# Altium project LimePSB-RPCM_1v2.PrjPcb (part 8 of 13)

## Sheet 11_RFFE.SchDoc: RF front end
size A3; Organization: Lime Microsystems; Address1: Surrey Tech Centre; Address2: Guildford GU2 7YG; Address3: Surrey; Address4: United Kingdom; Revision: v1.2; SheetNumber: 11; SheetTotal: 13
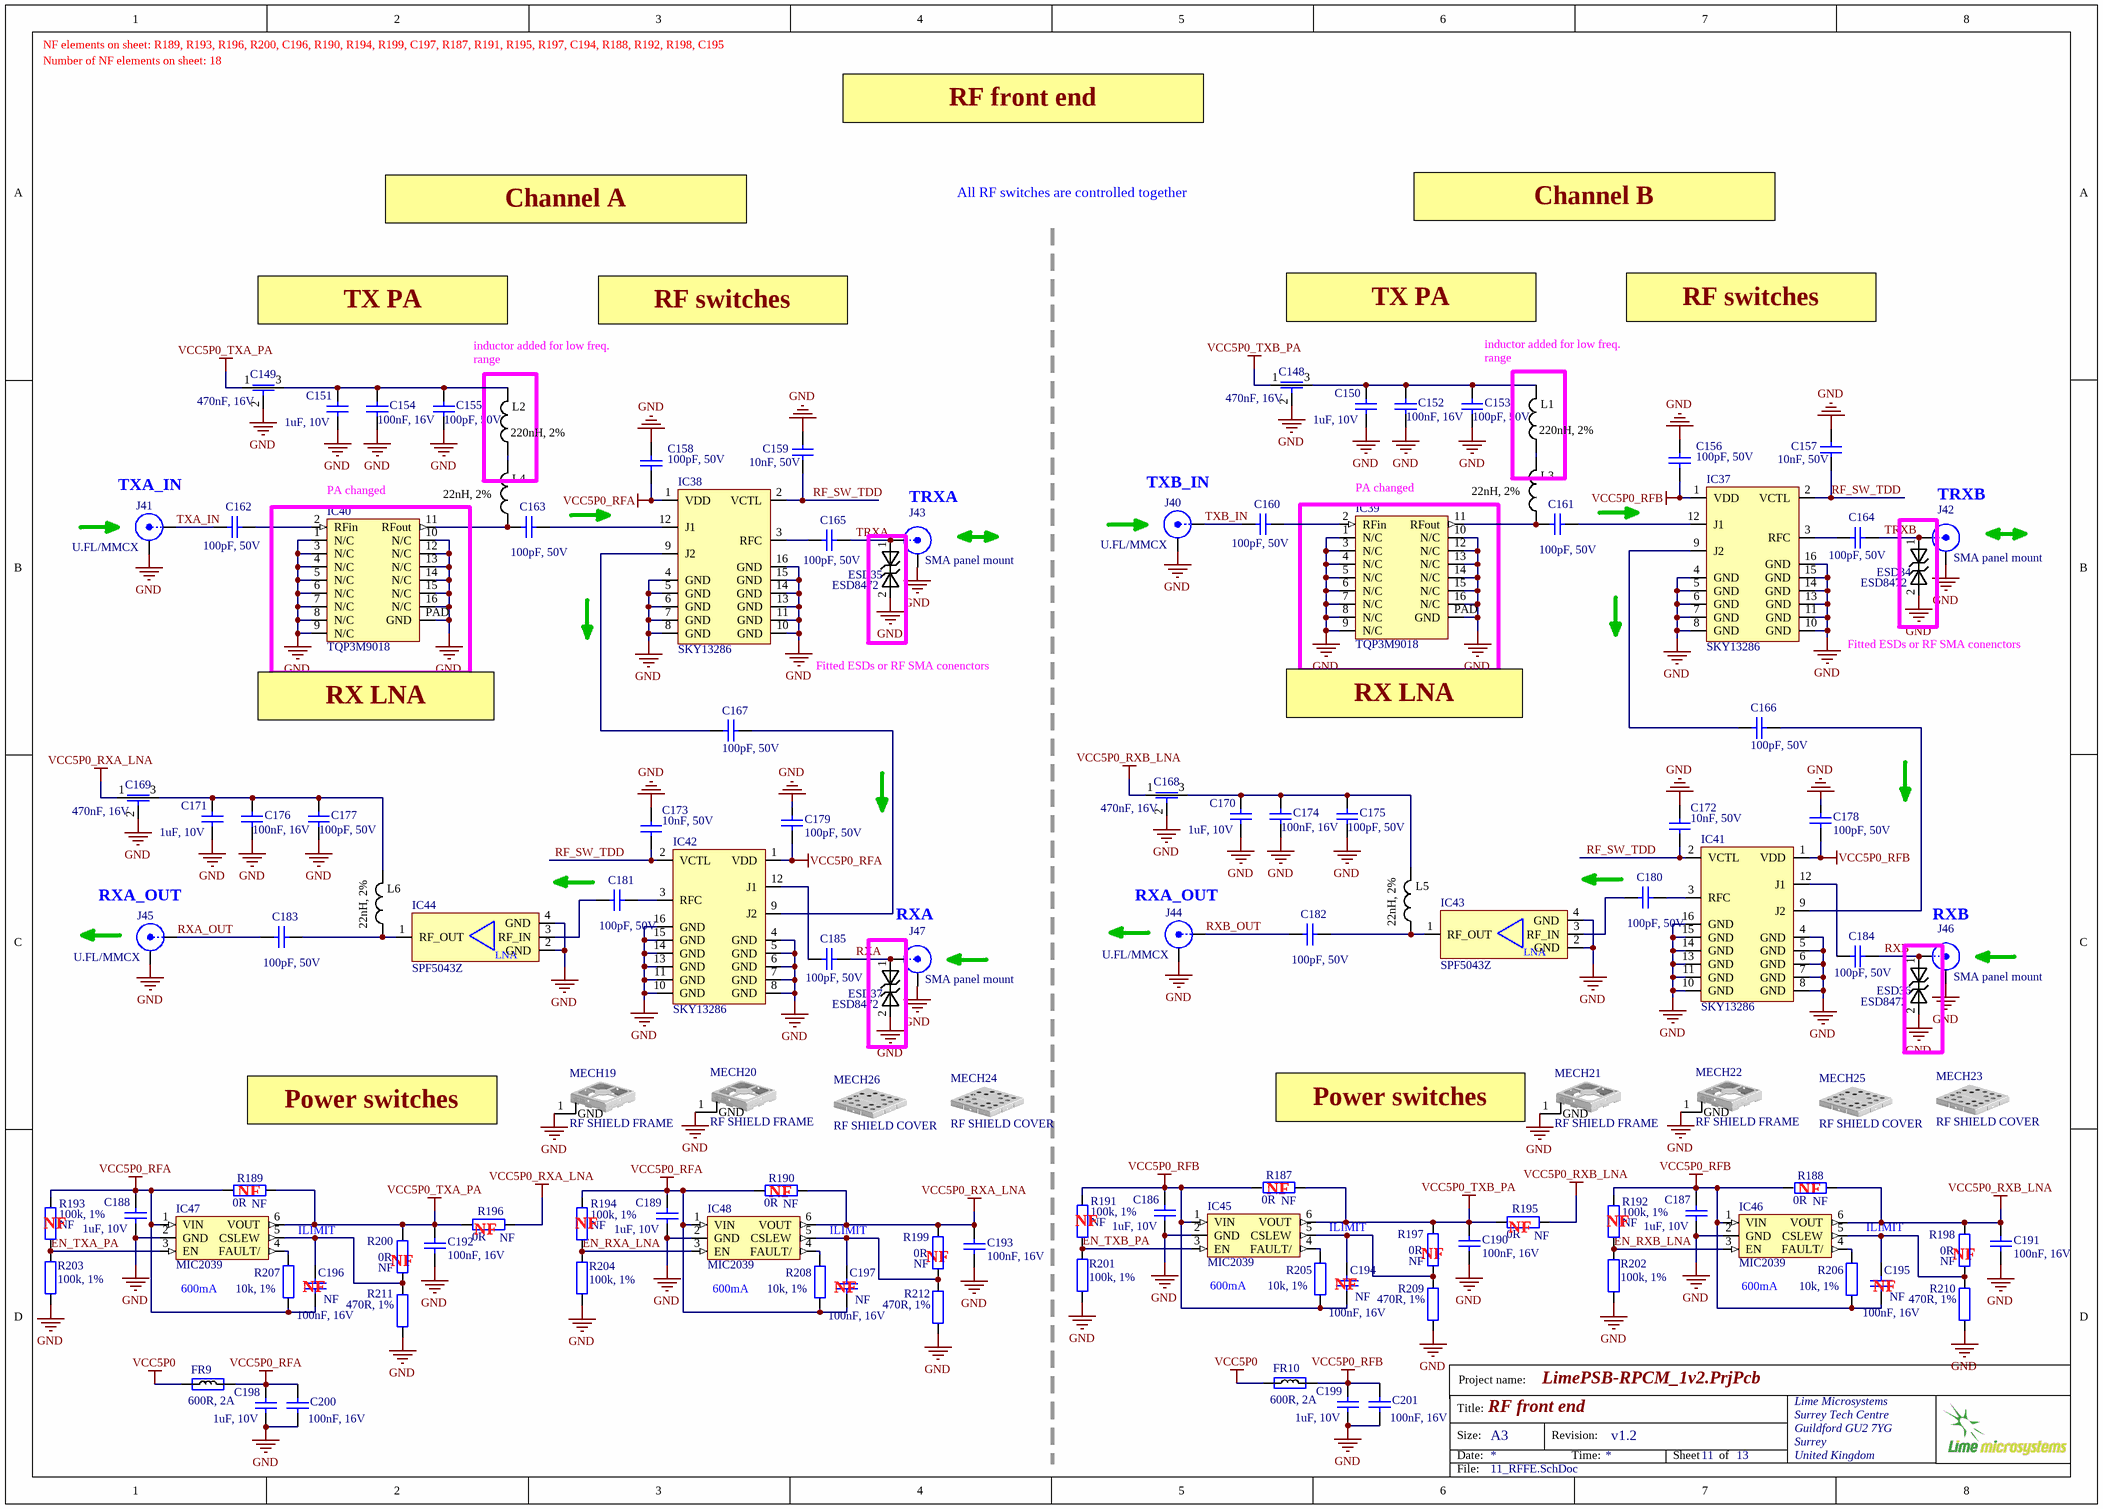
[diagram p10: 11_RFFE.SchDoc]

### Parts
C148  470nF, 16V  [CAP0805_FEEDTHROUGH]
C149  470nF, 16V  [CAP0805_FEEDTHROUGH]
C150  1uF, 10V  [CAP0402]
C151  1uF, 10V  [CAP0402]
C152  100nF, 16V  [CAP0402]
C153  100pF, 50V  [CAP0402]
C154  100nF, 16V  [CAP0402]
C155  100pF, 50V  [CAP0402]
C156  100pF, 50V  [CAP0402]
C157  10nF, 50V  [CAP0402]
C158  100pF, 50V  [CAP0402]
C159  10nF, 50V  [CAP0402]
C160  100pF, 50V  [CAP0402]
C161  100pF, 50V  [CAP0402]
C162  100pF, 50V  [CAP0402]
C163  100pF, 50V  [CAP0402]
C164  100pF, 50V  [CAP0402]
C165  100pF, 50V  [CAP0402]
C166  100pF, 50V  [CAP0402]
C167  100pF, 50V  [CAP0402]
C168  470nF, 16V  [CAP0805_FEEDTHROUGH]
C169  470nF, 16V  [CAP0805_FEEDTHROUGH]
C170  1uF, 10V  [CAP0402]
C171  1uF, 10V  [CAP0402]
C172  10nF, 50V  [CAP0402]
C173  10nF, 50V  [CAP0402]
C174  100nF, 16V  [CAP0402]
C175  100pF, 50V  [CAP0402]
C176  100nF, 16V  [CAP0402]
C177  100pF, 50V  [CAP0402]
C178  100pF, 50V  [CAP0402]
C179  100pF, 50V  [CAP0402]
C180  100pF, 50V  [CAP0402]
C181  100pF, 50V  [CAP0402]
C182  100pF, 50V  [CAP0402]
C183  100pF, 50V  [CAP0402]
C184  100pF, 50V  [CAP0402]
C185  100pF, 50V  [CAP0402]
C186  1uF, 10V  [CAP0402]
C187  1uF, 10V  [CAP0402]
C188  1uF, 10V  [CAP0402]
C189  1uF, 10V  [CAP0402]
C190  100nF, 16V  [CAP0402]
C191  100nF, 16V  [CAP0402]
C192  100nF, 16V  [CAP0402]
C193  100nF, 16V  [CAP0402]
C194  100nF, 16V  Assembly Info: NF  [CAP0402]
C195  100nF, 16V  Assembly Info: NF  [CAP0402]
C196  100nF, 16V  Assembly Info: NF  [CAP0402]
C197  100nF, 16V  Assembly Info: NF  [CAP0402]
C198  1uF, 10V  [CAP0402]
C199  1uF, 10V  [CAP0402]
C200  100nF, 16V  [CAP0402]
C201  100nF, 16V  [CAP0402]
ESD34  ESD8472  [ESD8472_X3DFN2]
ESD35  ESD8472  [ESD8472_X3DFN2]
ESD36  ESD8472  [ESD8472_X3DFN2]
ESD37  ESD8472  [ESD8472_X3DFN2]
FR9  600R, 2A  [RES0805]
FR10  600R, 2A  [RES0805]
IC37  SKY13286  [SKY13286-359LF_RF_switch_QFN16]
IC38  SKY13286  [SKY13286-359LF_RF_switch_QFN16]
IC39  TQP3M9018  [TQP3M9018_PA_QFN16]
IC40  TQP3M9018  [TQP3M9018_PA_QFN16]
IC41  SKY13286  [SKY13286-359LF_RF_switch_QFN16]
IC42  SKY13286  [SKY13286-359LF_RF_switch_QFN16]
IC43  SPF5043Z  [SPF5043Z_SOT-343]
IC44  SPF5043Z  [SPF5043Z_SOT-343]
IC45  MIC2039  [SOT23-6]
IC46  MIC2039  [SOT23-6]
IC47  MIC2039  [SOT23-6]
IC48  MIC2039  [SOT23-6]
J40  U.FL/MMCX  [MMCX_UFL_conn_u]
J41  U.FL/MMCX  [MMCX_UFL_conn_u]
J42  SMA panel mount  [SMA_connector_side]
J43  SMA panel mount  [SMA_connector_side]
J44  U.FL/MMCX  [MMCX_UFL_conn_u]
J45  U.FL/MMCX  [MMCX_UFL_conn_u]
J46  SMA panel mount  [SMA_connector_side]
J47  SMA panel mount  [SMA_connector_side]
L1  220nH, 2%  [RES0603]
L2  220nH, 2%  [RES0603]
L3  22nH, 2%  [RES0603]
L4  22nH, 2%  [RES0603]
L5  22nH, 2%  [RES0603]
L6  22nH, 2%  [RES0603]
MECH19  RF SHIELD FRAME  [RF_SHIELD_FRAME_16P5x16P5_2118716-2_v1]
MECH20  RF SHIELD FRAME  [RF_SHIELD_FRAME_16P5x16P5_2118716-2_v1]
MECH21  RF SHIELD FRAME  [RF_SHIELD_FRAME_16P5x16P5_2118716-2_v1]
MECH22  RF SHIELD FRAME  [RF_SHIELD_FRAME_16P5x16P5_2118716-2_v1]
MECH23  RF SHIELD COVER  [RF_SHIELD_COVER_16Px916P9_2118715-2]
MECH24  RF SHIELD COVER  [RF_SHIELD_COVER_16Px916P9_2118715-2]
MECH25  RF SHIELD COVER  [RF_SHIELD_COVER_16Px916P9_2118715-2]
MECH26  RF SHIELD COVER  [RF_SHIELD_COVER_16Px916P9_2118715-2]
R187  0R  Assembly Info: NF  [RES0402]
R188  0R  Assembly Info: NF  [RES0402]
R189  0R  Assembly Info: NF  [RES0402]
R190  0R  Assembly Info: NF  [RES0402]
R191  100k, 1%  Assembly Info: NF  [RES0402]
R192  100k, 1%  Assembly Info: NF  [RES0402]
R193  100k, 1%  Assembly Info: NF  [RES0402]
R194  100k, 1%  Assembly Info: NF  [RES0402]
R195  0R  Assembly Info: NF  [RES0805]
R196  0R  Assembly Info: NF  [RES0805]
R197  0R  Assembly Info: NF  [RES0402]
R198  0R  Assembly Info: NF  [RES0402]
R199  0R  Assembly Info: NF  [RES0402]
R200  0R  Assembly Info: NF  [RES0402]
R201  100k, 1%  [RES0402]
R202  100k, 1%  [RES0402]
R203  100k, 1%  [RES0402]
R204  100k, 1%  [RES0402]
R205  10k, 1%  [RES0402]
R206  10k, 1%  [RES0402]
R207  10k, 1%  [RES0402]
R208  10k, 1%  [RES0402]
R209  470R, 1%  [RES0402]
R210  470R, 1%  [RES0402]
R211  470R, 1%  [RES0402]
R212  470R, 1%  [RES0402]

### Blocks framed on the sheet
RXA: ESD37

### Nets
GND: C148.2 C149.2 C150.1 C151.1 C152.2 C153.1 C154.2 C155.1 C156.2 C157.1 C158.2 C159.1 C168.2 C169.2 C170.1 C171.1 C172.2 C173.2 C174.2 C175.1 C176.2 C177.1 C178.2 C179.2 C186.2 C187.2 C188.2 C189.2 C190.2 C191.2 C192.2 C193.2 C198.1 C199.1 C200.2 C201.2 ESD34.2 ESD35.2 ESD36.2 ESD37.2 IC37.4(GND) IC37.5(GND) IC37.6(GND) IC37.7(GND) IC37.8(GND) IC37.10(GND) IC37.11(GND) IC37.13(GND) IC37.14(GND) IC37.15(GND) IC37.16(GND) IC38.4(GND) IC38.5(GND) IC38.6(GND) IC38.7(GND) IC38.8(GND) IC38.10(GND) IC38.11(GND) IC38.13(GND) IC38.14(GND) IC38.15(GND) IC38.16(GND) IC39.1(N/C) IC39.3(N/C) IC39.4(N/C) IC39.5(N/C) IC39.6(N/C) IC39.7(N/C) IC39.8(N/C) IC39.9(N/C) IC39.10(N/C) IC39.12(N/C) IC39.13(N/C) IC39.14(N/C) IC39.15(N/C) IC39.16(N/C) IC39.PAD(GND) IC40.1(N/C) IC40.3(N/C) IC40.4(N/C) IC40.5(N/C) IC40.6(N/C) IC40.7(N/C) IC40.8(N/C) IC40.9(N/C) IC40.10(N/C) IC40.12(N/C) IC40.13(N/C) IC40.14(N/C) IC40.15(N/C) IC40.16(N/C) IC40.PAD(GND) IC41.4(GND) IC41.5(GND) IC41.6(GND) IC41.7(GND) IC41.8(GND) IC41.10(GND) IC41.11(GND) IC41.13(GND) IC41.14(GND) IC41.15(GND) IC41.16(GND) IC42.4(GND) IC42.5(GND) IC42.6(GND) IC42.7(GND) IC42.8(GND) IC42.10(GND) IC42.11(GND) IC42.13(GND) IC42.14(GND) IC42.15(GND) IC42.16(GND) IC43.2(GND) IC43.4(GND) IC44.2(GND) IC44.4(GND) IC45.2(GND) IC46.2(GND) IC47.2(GND) IC48.2(GND) J40.2(Y) J41.2(Y) J42.2(Y) J43.2(Y) J44.2(Y) J45.2(Y) J46.2(Y) J47.2(Y) MECH19.1(GND) MECH20.1(GND) MECH21.1(GND) MECH22.1(GND) R201.2 R202.2 R203.2 R204.2 R209.1 R210.1 R211.1 R212.1
VCC5P0: FR9.1 FR10.1
VCC5P0_RFA: C158.1 C179.1 C188.1 C189.1 C196.2 C197.2 C198.2 C200.1 FR9.2 IC38.1(VDD) IC42.1(VDD) IC47.1(VIN) IC48.1(VIN) R189.2 R190.2 R193.1 R194.1 R207.1 R208.1
VCC5P0_RFB: C156.1 C178.1 C186.1 C187.1 C194.2 C195.2 C199.2 C201.1 FR10.2 IC37.1(VDD) IC41.1(VDD) IC45.1(VIN) IC46.1(VIN) R187.2 R188.2 R191.1 R192.1 R205.1 R206.1
VCC5P0_RXA_LNA: C169.1 C193.1 IC48.6(VOUT) R190.1 R196.1 R199.2
VCC5P0_RXB_LNA: C168.1 C191.1 IC46.6(VOUT) R188.1 R195.1 R198.2
VCC5P0_TXA_PA: C149.1 C192.1 IC47.6(VOUT) R189.1 R196.2 R200.2
VCC5P0_TXB_PA: C148.1 C190.1 IC45.6(VOUT) R187.1 R195.2 R197.2
EN_RXA_LNA: IC48.3(EN) R194.2 R204.1
EN_RXB_LNA: IC46.3(EN) R192.2 R202.1
EN_TXA_PA: IC47.3(EN) R193.2 R203.1
EN_TXB_PA: IC45.3(EN) R191.2 R201.1
RF_SW_TDD: C157.2 C159.2 C172.1 C173.1 IC37.2(VCTL) IC38.2(VCTL) IC41.2(VCTL) IC42.2(VCTL)
RXA: C185.1 ESD37.1 J47.1(X)
RXA_OUT: C183.2 J45.1(X)
RXB: C184.1 ESD36.1 J46.1(X)
RXB_OUT: C182.2 J44.1(X)
TRXA: C165.1 ESD35.1 J43.1(X)
TRXB: C164.1 ESD34.1 J42.1(X)
TXA_IN: C162.2 J41.1(X)
TXB_IN: C160.2 J40.1(X)
NetC148_3: C148.3 C150.2 C152.1 C153.2 L1.1
NetC149_3: C149.3 C151.2 C154.1 C155.2 L2.1
NetC160_1: C160.1 IC39.2(RFin)
NetC161_1: C161.1 IC37.12(J1)
NetC161_2: C161.2 IC39.11(RFout) L3.2
NetC162_1: C162.1 IC40.2(RFin)
NetC163_1: C163.1 IC38.12(J1)
NetC163_2: C163.2 IC40.11(RFout) L4.2
NetC164_2: C164.2 IC37.3(RFC)
NetC165_2: C165.2 IC38.3(RFC)
NetC166_1: C166.1 IC41.9(J2)
NetC166_2: C166.2 IC37.9(J2)
NetC167_1: C167.1 IC42.9(J2)
NetC167_2: C167.2 IC38.9(J2)
NetC168_3: C168.3 C170.2 C174.1 C175.2 L5.1
NetC169_3: C169.3 C171.2 C176.1 C177.2 L6.1
NetC180_1: C180.1 IC41.3(RFC)
NetC180_2: C180.2 IC43.3(RF_IN)
NetC181_1: C181.1 IC42.3(RFC)
NetC181_2: C181.2 IC44.3(RF_IN)
NetC182_1: C182.1 IC43.1(RF_OUT) L5.2
NetC183_1: C183.1 IC44.1(RF_OUT) L6.2
NetC184_2: C184.2 IC41.12(J1)
NetC185_2: C185.2 IC42.12(J1)
NetC194_1: C194.1 IC45.5(CSLEW) R197.1 R209.2
NetC195_1: C195.1 IC46.5(CSLEW) R198.1 R210.2
NetC196_1: C196.1 IC47.5(CSLEW) R200.1 R211.2
NetC197_1: C197.1 IC48.5(CSLEW) R199.1 R212.2
NetIC45_4: IC45.4(FAULT/) R205.2
NetIC46_4: IC46.4(FAULT/) R206.2
NetIC47_4: IC47.4(FAULT/) R207.2
NetIC48_4: IC48.4(FAULT/) R208.2
NetL1_2: L1.2 L3.1
NetL2_2: L2.2 L4.1

### Notes on the sheet
- NF elements on sheet: R189, R193, R196, R200, C196, R190, R194, R199, C197, R187, R191, R195, R197, C194, R188, R192, R198, C195
- Number of NF elements on sheet: 18
- RF front end
- Channel A
- All RF switches are controlled together
- Channel B
- TX PA
- RF switches
- inductor added for low freq. range
- (near J41) TXA_IN
- (near IC40) PA changed
- TRXA
- (near J40) TXB_IN
- (near IC39) PA changed
- TRXB
- (near IC40) RX LNA
- Fitted ESDs or RF SMA conenctors
- (near IC39) RX LNA
- (near J45) RXA_OUT
- (near J44) RXA_OUT
- RXB
- Power switches
- (near MECH21) Power switches
- (near R187) NF
- (near R188) NF
- (near R193) NF
- (near R189) NF
- ILIMIT
- (near R196) NF
- (near R194) NF
- (near R190) NF
- (near R199) NF
- (near R191) NF
- (near R197) NF
- (near R195) NF
- (near R192) NF
- (near R198) NF
- (near IC47) 600mA
- NF
- (near R200) NF
- (near IC48) 600mA
- (near IC45) 600mA
- (near IC46) 600mA
- (near C195) NF
- Project name:
- Title:
- Size:
- Date:
- A3
- Revision:
- Time:
- Sheet
- of
- File:
- (in symbol SPF5043Z_RF_LNA) LNA

### Library data of the parts
C148 C149 C168 C169 = Cap_feed_through: Part Description: 0.47µF Feed Through Capacitor 16V 2A 30mOhm 0805 (2012 Metric), 3 PC Pad; Manufacturer: Murata; Manufacturer Part Number 1: NFM21PC474R1C3D; Max Current Rating: 2A; Tolerance: 20%; DC Resistance (DCR): 30mR; Insulation Resistance: 1GR; Value: 470nF, 16V; Supplier 1: Digi-Key; Supplier Part Number 1: 490-2537-1-ND; Stock 1: 220606; Pricing 1: 1=0,25000, 10=0,22900, 25=0,21840, 50=0,21160, 100=0,20450, 250=0,19392, 500=0,16218, 1000=0,12586 (USD); Mount: Surface Mount,PCB; Case/Package: 0805; Weight: 0.000194oz; Case Code (Metric): 2012; Case Code (Imperial): 0805; Min Operating Temperature: -55°C; Max Operating Temperature: 125°C; Package Quantity: 1; Capacitance: 470nF; Packaging: Tape and Reel; Max Voltage Rating (DC): 16V; Current Rating: 2A; Voltage Rating: 16V; Voltage Rating (DC): 16V; Voltage: 16V; Current: 2A; Termination: Flat; Length: 2mm; Height: 0.85mm; Width: 1.25mm; Depth: 1.25mm; Radiation Hardening: No; REACH SVHC: No SVHC; Lead Free: Lead Free; RoHS: Yes
C150 C151 C170 C171 C198 C199 = Cap_0402: as C105 on sheet 10_Clock; Value: 1uF, 10V; Supplier 1: Digi-Key; Supplier Part Number 1: 311-1732-1-ND; RoHS: RoHS Compliant; Applications: General Purpose; Category: Capacitors; ComponentLink1Description: http://www.yageo.com/documents/recent/UPY-GPHC_X5R_4V-to-50V_25.pdf; ComponentLink1URL: http://www.yageo.com/documents/recent/UPY-GPHC_X5R_4V-to-50V_25.pdf; Failure Rate: -; Features: -; Height - Seated (Max): -; Lead Spacing: -; Lead Style: -; Mounting Type: Surface Mount, MLCC; Operating Temperature: -55°C ~ 85°C; Package / Case: 0402 (1005 Metric); Packaging: Cut Tape (CT); Part Status: Active; Pricing 1: 1=0.22, 10=0.156, 100=0.0732, 500=0.0513, 1000=0.04248, 2500=0.03953, 5000=0.03617 (USD); Ratings: -; Size / Dimension: 0.039" L x 0.020" W (1.00mm x 0.50mm); Stock 1: 69600; Temperature Coefficient: X5R; Thickness (Max): 0.022" (0.55mm); Voltage - Rated: 10V
C152 C154 C174 C176 C190-C197 = Cap_0402: as C118 on sheet 10_Clock; Value: 100nF, 16V; Supplier 1: Mouser; Supplier Part Number 1: 81-GRM155R71C104KA88; Case Code - in: 0402; RoHS: RoHS Compliant; Operating Temperature Range: - 55 C to + 125 C; Series: GRM; Termination Style: SMD/SMT; Package / Case: 0402 (1005 metric); Voltage Rating DC: 16 V; Maximum Operating Temperature: + 125 C; Case Code - mm: 1005; Minimum Operating Temperature: - 55 C; Product Category: Low & Medium Capacitance SMD Ceramic Chip Capacitors; Packaging: Reel; Product: General Type MLCCs; Category: Multilayer Ceramic Capacitors MLCC - SMD/SMT; Brand: Murata Electronics; Case Width: 0.5 mm; RoHS - Mouser: Y; Standard Pack Qty: 10000; Minimum Order Quantity: 1; Reeling: True; Manufacturer Part Number: GRM155R71C104KA88D
C153 C155 C156 C158 C160-C167 C175 C177-C185 = Cap_0402: as C99 on sheet 10_Clock; Value: 100pF, 50V; Capacitance: 100pF; Thickness (Max): 0.022" (0.55mm); Size / Dimension: 0.039" L x 0.020" W (1.00mm x 0.50mm); RoHS: RoHS Compliant; Ratings: -; Package / Case: 0402 (1005 Metric); Mounting Type: Surface Mount, MLCC; Height - Seated (Max): -; Features: -; Lead Spacing: -; Voltage - Rated: 50V; Operating Temperature: -55°C ~ 125°C; Packaging: Cut Tape (CT); Applications: General Purpose; Lead Style: -; Supplier 1: Digi-Key; Category: Capacitors; Supplier Part Number 1: 311-1024-1-ND
C157 C159 C172 C173 = Cap_0402: Part Description: 10000pF ±10% 50V Ceramic Capacitor X7R 0402 (1005 Metric); Manufacturer: Murata Electronics North America; Manufacturer Part Number 1: GRM155R71H103KA88D; Tolerance: ±10%; Temperature Coefficient: X7R; Value: 10nF, 50V; Supplier 1: Digi-Key; Supplier Part Number 1: 490-4516-2-ND; RoHS: RoHS Compliant; Category: Capacitors; Stock 1: 10970000; Pricing 1: 10000=0.00185, 20000=0.00176, 30000=0.00167 (USD); Packaging: Tape & Reel (TR); Part Status: Active; Voltage - Rated: 50V; Operating Temperature: -55°C ~ 125°C; Features: -; Ratings: -; Applications: General Purpose; Mounting Type: Surface Mount, MLCC; Package / Case: 0402 (1005 Metric); Size / Dimension: 0.039" L x 0.020" W (1.00mm x 0.50mm); Height - Seated (Max): -; Thickness (Max): 0.022" (0.55mm); Lead Spacing: -; Lead Style: -; ComponentLink1URL: http://www.murata.com/~/media/webrenewal/support/library/catalog/products/capacitor/mlcc/c02e.ashx?la=en-us; ComponentLink1Description: http://www.murata.com/~/media/webrenewal/support/library/catalog/products/capacitor/mlcc/c02e.ashx?la=en-us
C186-C189 = Cap_0402: as C120 on sheet 10_Clock; Value: 1uF, 10V; Supplier 1: Digi-Key; Supplier Part Number 1: 311-1732-1-ND; MSL: -; RoHS: YES
C200 C201 = Cap_0603: as C129 on sheet 10_Clock; Supplier 1: Mouser; Supplier Part Number 1: 81-GRM155R71C104KA88; Case Code - in: 0402; Manufacturer: Murata Electronics; Category: Multilayer Ceramic Capacitors MLCC - SMD/SMT; Voltage Rating DC: 16 V; Value: 100nF, 16V; Manufacturer Part Number: GRM155R71C104KA88D; Case Code - mm: 1005; Case Width: 0.5 mm; Maximum Operating Temperature: + 125 C; Minimum Operating Temperature: - 55 C; Minimum Order Quantity: 1; Operating Temperature Range: - 55 C to + 125 C; Package / Case: 0402 (1005 metric); Packaging: Reel; Product: General Type MLCCs; Product Category: Low & Medium Capacitance SMD Ceramic Chip Capacitors; Reeling: True; RoHS - Mouser: Y; RoHS: RoHS Compliant; Series: GRM; Standard Pack Qty: 10000; Termination Style: SMD/SMT
ESD34-ESD37 = ESD8472: Manufacturer: ON Semiconductor; Manufacturer Part Number 1: ESD8472MUT5G; Part Description: TVS DIODE 5.3VWM 14VC X3DFN2; Voltage - Reverse Standoff (Typ): 5.3V (Max); Voltage - Breakdown (Min): 7V; Voltage - Clamping (Max) @ Ipp: 14V; Current - Peak Pulse (10/1000µs): 3A (8/20µs); Power Line Protection: No; Capacitance @ Frequency: 0.2pF @ 1MHz; Supplier 1: Digi-Key; RoHS: RoHS Compliant; Category: Circuit Protection; Stock 1: 2295; Pricing 1: 1=0.39, 10=0.315, 100=0.2142, 500=0.16068, 1000=0.12051 (USD); Packaging: Cut Tape (CT); Part Status: Active; Type: Zener; Power - Peak Pulse: -; Applications: Automotive, RF Antenna; Operating Temperature: -55°C ~ 150°C (TJ); Mounting Type: Surface Mount; Package / Case: 2-XFDFN; Supplier Device Package: 2-X3DFN (0.62x0.32); ComponentLink1URL: http://www.onsemi.com/pub/Collateral/ESD8472-D.PDF; ComponentLink1Description: http://www.onsemi.com/pub/Collateral/ESD8472-D.PDF; Supplier Part Number 1: ESD8472MUT5GOSCT-ND
FR9 FR10 = Ferrite: Manufacturer Part Number 1: MPZ2012S601AT000; Manufacturer: TDK Corporation; Part Description: FERRITE BEAD 600 OHM 0805 1LN; Filter Type: Differential Mode - Single; Impedance @ Frequency: 600 Ohm @ 100MHz; DC Resistance (DCR): 100 mOhm Max; Supplier 1: Digi-Key; Supplier Part Number 1: 445-2206-2-ND; Mounting Type: Surface Mount; RoHS: RoHS Compliant; Height (Max): 0.041" (1.05mm); Packaging: Tape & Reel (TR); Category: Filters; Current Rating: 2A; Package / Case: 0805 (2012 Metric); Size / Dimension: 0.079" L x 0.049" W (2.00mm x 1.25mm); Value: 600R, 2A
IC37 IC38 IC41 IC42 = SKY13286-359LF_RF_switch: Part Description: RF Switch IC GSM, ISM, PCS, WCDMA SPDT 6 GHz 50Ohm 16-QFN (4x4); Manufacturer: Skyworks Solutions; Frequency: 6GHz; Impedance: 50R; Insertion Loss: 1.8dB; Turn-Off Delay Time: 50ns; Throw Configuration: SPDT; IIP3: 46dBm; Operating Frequency: 100 MHz to 6 GHz; Number of Switches: 3; Min Supply Voltage: 2.7V; Max Supply Voltage: 5.5V; P1dB: 30dBm; Min Frequency: 100MHz; Supplier 1: Digi-Key; Supplier Part Number 1: 863-1049-1-ND; Manufacturer Part Number 1: SKY13286-359LF; Stock 1: 60609; Pricing 1: 1=3,45000, 10=3,09600, 25=2,92720, 100=2,53700, 250=2,40684, 500=2,15966, 1000=1,95150 (USD); RoHS: Yes; Mount: Surface Mount; Case/Package: QFN; Number of Pins: 16; Contact Plating: Tin,Matte; Min Operating Temperature: -40°C; Max Operating Temperature: 95°C; Package Quantity: 1; Packaging: Tape and Reel; Turn-On Delay Time: 50ns; Max Frequency: 6GHz; Series: -; Termination: SMD/SMT; Radiation Hardening: No; RoHS Compliant: Yes; REACH SVHC: Unknown; ComponentLink1URL: https://datasheet.ciiva.com/15100/getdatasheetpartid-656005-15100455.pdf?src-supplier=Verical; ComponentLink1Description: https://datasheet.ciiva.com/15100/getdatasheetpartid-656005-15100455.pdf?src-supplier=Verical; ComponentLink2URL: https://datasheet.ciiva.com/12080/200570h-20342-12080171.pdf?src-supplier=Mouser; ComponentLink2Description: https://datasheet.ciiva.com/12080/200570h-20342-12080171.pdf?src-supplier=Mouser
IC39 IC40 = TQP3M9018_PA: Part Description: RF Amplifier .05-4GHz P1dB= 22dB Gain 26.4dB 5Volts; Manufacturer: Qorvo; Manufacturer Part Number 1: TQP3M9019; Supplier 1: Mouser; Supplier Part Number 1: 772-TQP3M9019; Stock 1: 6804; Pricing 1: 1=7,48, 10=7,48, 50=5,43, 100=4,41, 1000=2,44, 10000=2,35 (USD); RoHS: Yes
IC43 IC44 = SPF5043Z_RF_LNA: Part Description: RF Amplifier .05-4GHz SSG 12.9dB NF .8dB GaAs; Manufacturer: Qorvo; Supplier 1: Mouser; Supplier Part Number 1: 772-SPF5043Z; Manufacturer Part Number 1: SPF5043Z; Stock 1: 151851; Pricing 1: 1=3,68000, 10=3,68000, 50=2,67000, 100=2,17000, 1000=1,20000, 10000=1,06000 (USD); RoHS: Yes; RoHS Compliant: Yes
IC45-IC48 = MIC2033_power_switch: Part Description: Power Switch/Driver 1:1 P-Channel 2.5A SOT-23-6; Manufacturer: Microchip; Manufacturer Part Number 1: MIC2039EYM6-TR; Number of Outputs: 1; Interface: On/Off; Max Output Current: 2.5A; Fault Protection: Over Temperature; Output Configuration: High Side; ComponentLink1URL: http://www.mouser.com/ds/2/268/mic2033-b-1076865.pdf?src-supplier=Mouser; ComponentLink1Description: http://www.mouser.com/ds/2/268/mic2033-b-1076865.pdf?src-supplier=Mouser; ComponentLink2URL: http://components.arrow.com/part/dataview/56727820S413982N1374?src-supplier=Arrow+Electronics; ComponentLink2Description: http://components.arrow.com/part/dataview/56727820S413982N1374?src-supplier=Arrow+Electronics; ComponentLink3URL: http://www.microchip.com/mymicrochip/filehandler.aspx?ddocname=en579457&src-supplier=Digi-Key; ComponentLink3Description: http://www.microchip.com/mymicrochip/filehandler.aspx?ddocname=en579457&src-supplier=Digi-Key; Supplier 1: Digi-Key; Supplier Part Number 1: 576-4193-1-ND; Stock 1: 37195; Pricing 1: 1=0,98000, 25=0,80560, 100=0,75000 (USD); RoHS: No; Case/Package: SOT-23-6; Min Operating Temperature: -40°C; Max Operating Temperature: 125°C; Package Quantity: 3000; Packaging: Tape and Reel; Series: -; ComponentLink4URL: https://datasheet.ciiva.com/6607/mic2039-6607725.pdf?src-supplier=Digi-Key; ComponentLink4Description: https://datasheet.ciiva.com/6607/mic2039-6607725.pdf?src-supplier=Digi-Key
J40 J41 J44 J45 = RF_IF_connector: as J33 on sheet 10_Clock; Cable Group: -; Category: Connectors, Interconnects; Fastening Type: Snap-On; Features: -; Housing Color: Silver; Ingress Protection: -; Mounting Type: Surface Mount; Operating Temperature: -40°C ~ 90°C; Packaging: Cut Tape (CT); RoHS: RoHS Compliant; Shield Termination: Solder; Supplier 1: Digi-Key; Supplier Part Number 1: WM5587CT-ND; Part Description: CONN UMC RCPT STR 50 OHM SMD
J42 J43 J46 J47 = RF_IF_connector: as J32 on sheet 10_Clock; Supplier 1: Digi-Key; Supplier Part Number 1: CONSMA002-L-G-ND; Stock 1: 815; Pricing 1: 1=4.08, 25=3.67, 100=3.32, 250=3.25, 500=3, 1000=2.80001, 2000=2.5875 (USD)
L1 L2 = Inductor: Part Description: Fixed Inductors 22 NH 2%; Manufacturer: TDK; Manufacturer Part Number 1: MLZ1608DR22DT000; Value: 220nH, 2%; ComponentLink1URL: http://productfinder.pulseeng.com/products/datasheets/WC701.pdf; ComponentLink1Description: http://productfinder.pulseeng.com/products/datasheets/WC701.pdf; ComponentLink2URL: https://datasheet.ciiva.com/11799/0900766b80a002db-11799279.pdf?src-supplier=RSComponents; ComponentLink2Description: https://datasheet.ciiva.com/11799/0900766b80a002db-11799279.pdf?src-supplier=RSComponents; ComponentLink3URL: https://datasheet.ciiva.com/14124/qhlqw18a-data-e-14124619.pdf?src-supplier=Distrelec; ComponentLink3Description: https://datasheet.ciiva.com/14124/qhlqw18a-data-e-14124619.pdf?src-supplier=Distrelec; ComponentLink4URL: https://datasheet.ciiva.com/6705/l0075s0080lqw18a-00-6705627.pdf?src-supplier=Digi-Key; ComponentLink4Description: https://datasheet.ciiva.com/6705/l0075s0080lqw18a-00-6705627.pdf?src-supplier=Digi-Key; ComponentLink5URL: https://datasheet.ciiva.com/6705/l0075s0080lqw18a-00-6705626.pdf?src-supplier=Digi-Key; ComponentLink5Description: https://datasheet.ciiva.com/6705/l0075s0080lqw18a-00-6705626.pdf?src-supplier=Digi-Key; ComponentLink6URL: https://datasheet.ciiva.com/6705/l0075s0080lqw18a-00-6705631.pdf?src-supplier=Digi-Key; ComponentLink6Description: https://datasheet.ciiva.com/6705/l0075s0080lqw18a-00-6705631.pdf?src-supplier=Digi-Key; ComponentLink7URL: https://datasheet.ciiva.com/4977/product-4977173.pdf?src-supplier=Mouser; ComponentLink7Description: https://datasheet.ciiva.com/4977/product-4977173.pdf?src-supplier=Mouser; ComponentLink8URL: https://datasheet.ciiva.com/46391/1487239-46391853.pdf?src-supplier=Element14; ComponentLink8Description: https://datasheet.ciiva.com/46391/1487239-46391853.pdf?src-supplier=Element14; ComponentLink9URL: https://datasheet.ciiva.com/8507/l0075s0080lqw18a-00-8507496.pdf?src-supplier=Avnet; ComponentLink9Description: https://datasheet.ciiva.com/8507/l0075s0080lqw18a-00-8507496.pdf?src-supplier=Avnet; Supplier 1: Digikey; Supplier Part Number 1: 445-6387-1-ND; Stock 1: 11427; Pricing 1: 1=0,12, 10=0,095, 25=0,0876, 50=0,0772, 100=0,0676, 250=0,06436, 500=0,06052, 1000=0,04635 (USD); RoHS: Yes; ComponentLink10URL: https://datasheet.ciiva.com/29698/inductor-commercial-decoupling-mlz-en-29698909.pdf?src-supplier=Digikey; ComponentLink10Description: https://datasheet.ciiva.com/29698/inductor-commercial-decoupling-mlz-en-29698909.pdf?src-supplier=Digikey; ComponentLink11URL: https://datasheet.ciiva.com/29698/inductor-commercial-decoupling-mlz-en-29698910.pdf?src-supplier=Digikey; ComponentLink11Description: https://datasheet.ciiva.com/29698/inductor-commercial-decoupling-mlz-en-29698910.pdf?src-supplier=Digikey; ComponentLink12URL: https://datasheet.ciiva.com/29698/inductor-commercial-decoupling-mlz-en-29698911.pdf?src-supplier=Digikey; ComponentLink12Description: https://datasheet.ciiva.com/29698/inductor-commercial-decoupling-mlz-en-29698911.pdf?src-supplier=Digikey
L3-L6 = Inductor: Manufacturer: Murata; Manufacturer Part Number 1: LQW18AN22NG00D; Part Description: Fixed Inductors 22 NH 2%; Core Material: Non-Magnetic; Self Resonant Frequency: 4.6GHz; Shielding: Unshielded; Q Factor: 40; Current Rating: 500mA; DC Resistance (DCR): 170mR; Test Frequency: 100MHz; Current: 400mA; Value: 22nH, 2%; ComponentLink1URL: http://productfinder.pulseeng.com/products/datasheets/WC701.pdf; ComponentLink1Description: http://productfinder.pulseeng.com/products/datasheets/WC701.pdf; Parameter 1: *; Supplier 1: Digi-Key; Supplier Part Number 1: 490-6874-1-ND; Stock 1: 60315; Pricing 1: 1=0,18000, 10=0,16300, 25=0,14520, 50=0,12340, 100=0,10890, 250=0,09984, 500=0,09076, 1000=0,07623 (USD); RoHS: Yes; Mount: Surface Mount; Case/Package: 0603; Number of Pins: 2; Weight: 0.000106oz; Case Code (Metric): 1608; Case Code (Imperial): 0603; Min Operating Temperature: -55°C; Max Operating Temperature: 125°C; Tolerance: 2%; Inductance Tolerance: 2%; Packaging: Tape and Reel; Package Quantity: 4000; Inductance: 22nH; Max DC Current: 500mA; Termination: SMD/SMT; Resistor Type: Wirewound; DC Current: 500mA; Series Resistance: 170mR; Series: LQW18A_00; Rated Current-Max: 500mA; Length: 1.6mm; Width: 0.8mm; Height: 0.8mm; Height - Seated (Max): 0.039inch; Depth: 1mm; REACH SVHC: No SVHC; Military Standard: Not; Lead Free: Lead Free; RoHS Compliant: Yes; ComponentLink2URL: https://datasheet.ciiva.com/11799/0900766b80a002db-11799279.pdf?src-supplier=RSComponents; ComponentLink2Description: https://datasheet.ciiva.com/11799/0900766b80a002db-11799279.pdf?src-supplier=RSComponents; ComponentLink3URL: https://datasheet.ciiva.com/14124/qhlqw18a-data-e-14124619.pdf?src-supplier=Distrelec; ComponentLink3Description: https://datasheet.ciiva.com/14124/qhlqw18a-data-e-14124619.pdf?src-supplier=Distrelec; ComponentLink4URL: https://datasheet.ciiva.com/6705/l0075s0080lqw18a-00-6705627.pdf?src-supplier=Digi-Key; ComponentLink4Description: https://datasheet.ciiva.com/6705/l0075s0080lqw18a-00-6705627.pdf?src-supplier=Digi-Key; ComponentLink5URL: https://datasheet.ciiva.com/6705/l0075s0080lqw18a-00-6705626.pdf?src-supplier=Digi-Key; ComponentLink5Description: https://datasheet.ciiva.com/6705/l0075s0080lqw18a-00-6705626.pdf?src-supplier=Digi-Key; ComponentLink6URL: https://datasheet.ciiva.com/6705/l0075s0080lqw18a-00-6705631.pdf?src-supplier=Digi-Key; ComponentLink6Description: https://datasheet.ciiva.com/6705/l0075s0080lqw18a-00-6705631.pdf?src-supplier=Digi-Key; ComponentLink7URL: https://datasheet.ciiva.com/4977/product-4977173.pdf?src-supplier=Mouser; ComponentLink7Description: https://datasheet.ciiva.com/4977/product-4977173.pdf?src-supplier=Mouser; ComponentLink8URL: https://datasheet.ciiva.com/46391/1487239-46391853.pdf?src-supplier=Element14; ComponentLink8Description: https://datasheet.ciiva.com/46391/1487239-46391853.pdf?src-supplier=Element14; ComponentLink9URL: https://datasheet.ciiva.com/8507/l0075s0080lqw18a-00-8507496.pdf?src-supplier=Avnet; ComponentLink9Description: https://datasheet.ciiva.com/8507/l0075s0080lqw18a-00-8507496.pdf?src-supplier=Avnet
MECH19-MECH22 = RF_SHIELD_FRAME_16P5x16P5_2118716-2: Part Description: RF Shield Frame 0.650" (16.50mm) X 0.650" (16.50mm) Surface Mount; Manufacturer: TE Connectivity; Supplier 1: Digi-Key; Supplier Part Number 1: A126152CT-ND; Manufacturer Part Number 1: 2118716-2; Stock 1: 26553; Pricing 1: 1=0,93000, 10=0,81600, 25=0,76680, 100=0,62570, 250=0,58120 (USD); RoHS: Yes; ComponentLink1URL: https://www.te.com/commerce/DocumentDelivery/DDEController?Action=srchrtrv&DocNm=2118716&DocType=Customer+Drawing&DocLang=English&src-supplier=Digi-Key; ComponentLink1Description: https://www.te.com/commerce/DocumentDelivery/DDEController?Action=srchrtrv&DocNm=2118716&DocType=Customer+Drawing&DocLang=English&src-supplier=Digi-Key
MECH23-MECH26 = RF_SHIELD_COVER_16P9x16P9_2118715-2: Part Description: RF Shield Cover 0.665" (16.90mm) X 0.665" (16.90mm) Vented Surface Mount; Manufacturer: TE Connectivity; ComponentLink1URL: https://www.te.com/commerce/DocumentDelivery/DDEController?Action=srchrtrv&DocNm=2118716&DocType=Customer+Drawing&DocLang=English&src-supplier=Digi-Key; ComponentLink1Description: https://www.te.com/commerce/DocumentDelivery/DDEController?Action=srchrtrv&DocNm=2118716&DocType=Customer+Drawing&DocLang=English&src-supplier=Digi-Key; Supplier 1: Digi-Key; Supplier Part Number 1: A126120-ND; Manufacturer Part Number 1: 2118715-2; Stock 1: 58094; Pricing 1: 1=1,44000, 10=1,28900, 25=1,22400, 100=1,00530, 250=0,93972, 500=0,83046, 1000=0,65562, 2500=0,61191, 5000=0,58132 (USD); RoHS: Yes; ComponentLink2URL: https://www.te.com/commerce/DocumentDelivery/DDEController?Action=srchrtrv&DocNm=2118715&DocType=Customer+Drawing&DocLang=English&src-supplier=Digi-Key; ComponentLink2Description: https://www.te.com/commerce/DocumentDelivery/DDEController?Action=srchrtrv&DocNm=2118715&DocType=Customer+Drawing&DocLang=English&src-supplier=Digi-Key
R187-R190 R197-R200 = Res_0402: as R145-R148 on sheet 10_Clock; Value: 0R; Supplier 1: Digi-Key; Supplier Part Number 1: 311-0.0JRTR-ND; Category: Resistors; Temperature Coefficient: -; Features: Moisture Resistant; Supplier Device Package: 0402; Height: 0.016" (0.40mm); Package / Case: 0402 (1005 Metric); Operating Temperature: -55°C ~ 155°C; Size / Dimension: 0.039" L x 0.020" W (1.00mm x 0.50mm); Composition: Thick Film; Packaging: Tape & Reel (TR); Number of Terminations: 2; RoHS: RoHS Compliant
R191-R194 R201-R204 = Res_0402: Part Description: 100 kOhms ±1% 0.063W, 1/16W Chip Resistor 0402 (1005 Metric) Thick Film; Manufacturer: Vishay; Manufacturer Part Number 1: CRCW0402100KFKEDC; Power Rating: 62.5mW; Resistance: 100kR; Temperature Coefficient: 100ppm/°C; Value: 100k, 1%; Supplier 1: Digi-Key; Supplier Part Number 1: 541-3960-6-ND; Stock 1: 702107; Pricing 1: 1=0,10000, 10=0,03300, 100=0,01360, 1000=0,00610, 2500=0,00529, 5000=0,00437 (USD); RoHS: Yes; Mount: Surface Mount; Case/Package: SMD/SMT; Contact Plating: Tin; Min Operating Temperature: -55°C; Max Operating Temperature: 155°C; Tolerance: 1%; Resistor Type: Thick Film; Termination: Wraparound; Length: 1mm; Lead Free: Lead Free; RoHS Compliant: Yes; ComponentLink1URL: http://www.vishay.com/docs/28773/crcwce3.pdf?src-supplier=Digi-Key; ComponentLink1Description: http://www.vishay.com/docs/28773/crcwce3.pdf?src-supplier=Digi-Key
R195 R196 = Res_0402: Manufacturer Part Number 1: CRCW08050000Z0EA; Manufacturer: Vishay Dale; Part Description: RES SMD 0.0 OHM JUMPER 1/8W 0805; Power (Watts): 0.125W, 1/8W; Resistance (Ohms): 0.0; Tolerance: Jumper; Value: 0R; Supplier 1: Digi-Key; Supplier Part Number 1: 541-0.0ATR-ND; Package / Case: 0805 (2012 Metric); Height: 0.020" (0.50mm); Packaging: Tape & Reel (TR); Operating Temperature: -55°C ~ 155°C; Temperature Coefficient: -; RoHS: RoHS Compliant; Size / Dimension: 0.079" L x 0.049" W (2.00mm x 1.25mm); Supplier Device Package: 0805 (2012 Metric); Number of Terminations: 2; Category: Resistors; Features: Automotive AEC-Q200; Composition: Thick Film
R205-R208 = Res_0402: as R172 on sheet 10_Clock; Value: 10k, 1%; Supplier 1: Digi-Key; Supplier Part Number 1: 311-10.0KLRTR-ND; Resistance (Ohms): 10k; Packaging: Tape & Reel (TR); RoHS: RoHS Compliant; Package / Case: 0402 (1005 Metric); Tolerance: ±1%; Operating Temperature: -55°C ~ 155°C; Size / Dimension: 0.039" L x 0.020" W (1.00mm x 0.50mm); Number of Terminations: 2; Category: Resistors; Height: 0.016" (0.40mm); Supplier Device Package: 0402; Features: Moisture Resistant; Composition: Thick Film
R209-R212 = Res_0402: as R169 on sheet 10_Clock; Value: 470R, 1%; Supplier 1: Digi-Key; Supplier Part Number 1: 311-470LRCT-ND; Stock 1: 1652476; Pricing 1: 1=0,10000, 10=0,01600, 100=0,00660, 1000=0,00299, 2500=0,00259, 5000=0,00214 (USD); RoHS: Yes; Case/Package: 0402; Case Code (Metric): 1005; Case Code (Imperial): 0402; Size Code: 0402; Min Operating Temperature: -55°C; Max Operating Temperature: 155°C; Packaging: Tape and Reel; Tolerance: 1%; Resistance: 470R; Number of Terminations: 2; Features: Moisture Resistant; Package Quantity: 1; Resistor Type: Thick Film; Termination: SMD/SMT; Series: RC; Resistance Tolerance: 1%; Construction: Rectangular; Length: 1mm; Width: 0.02inch; Height: 0.016inch; Depth: 0.5mm; Lead Free: Lead Free; REACH SVHC: Unknown; Military Standard: Not; RoHS Compliant: Yes; Manufacturer: Yageo

## Sheet 12_PoE_USB_PD.SchDoc: PoE and USB PD
size A3; Organization: Lime Microsystems; Address1: Surrey Tech Centre; Address2: Guildford GU2 7YG; Address3: Surrey; Address4: United Kingdom; Revision: v1.2; SheetNumber: 12; SheetTotal: 13
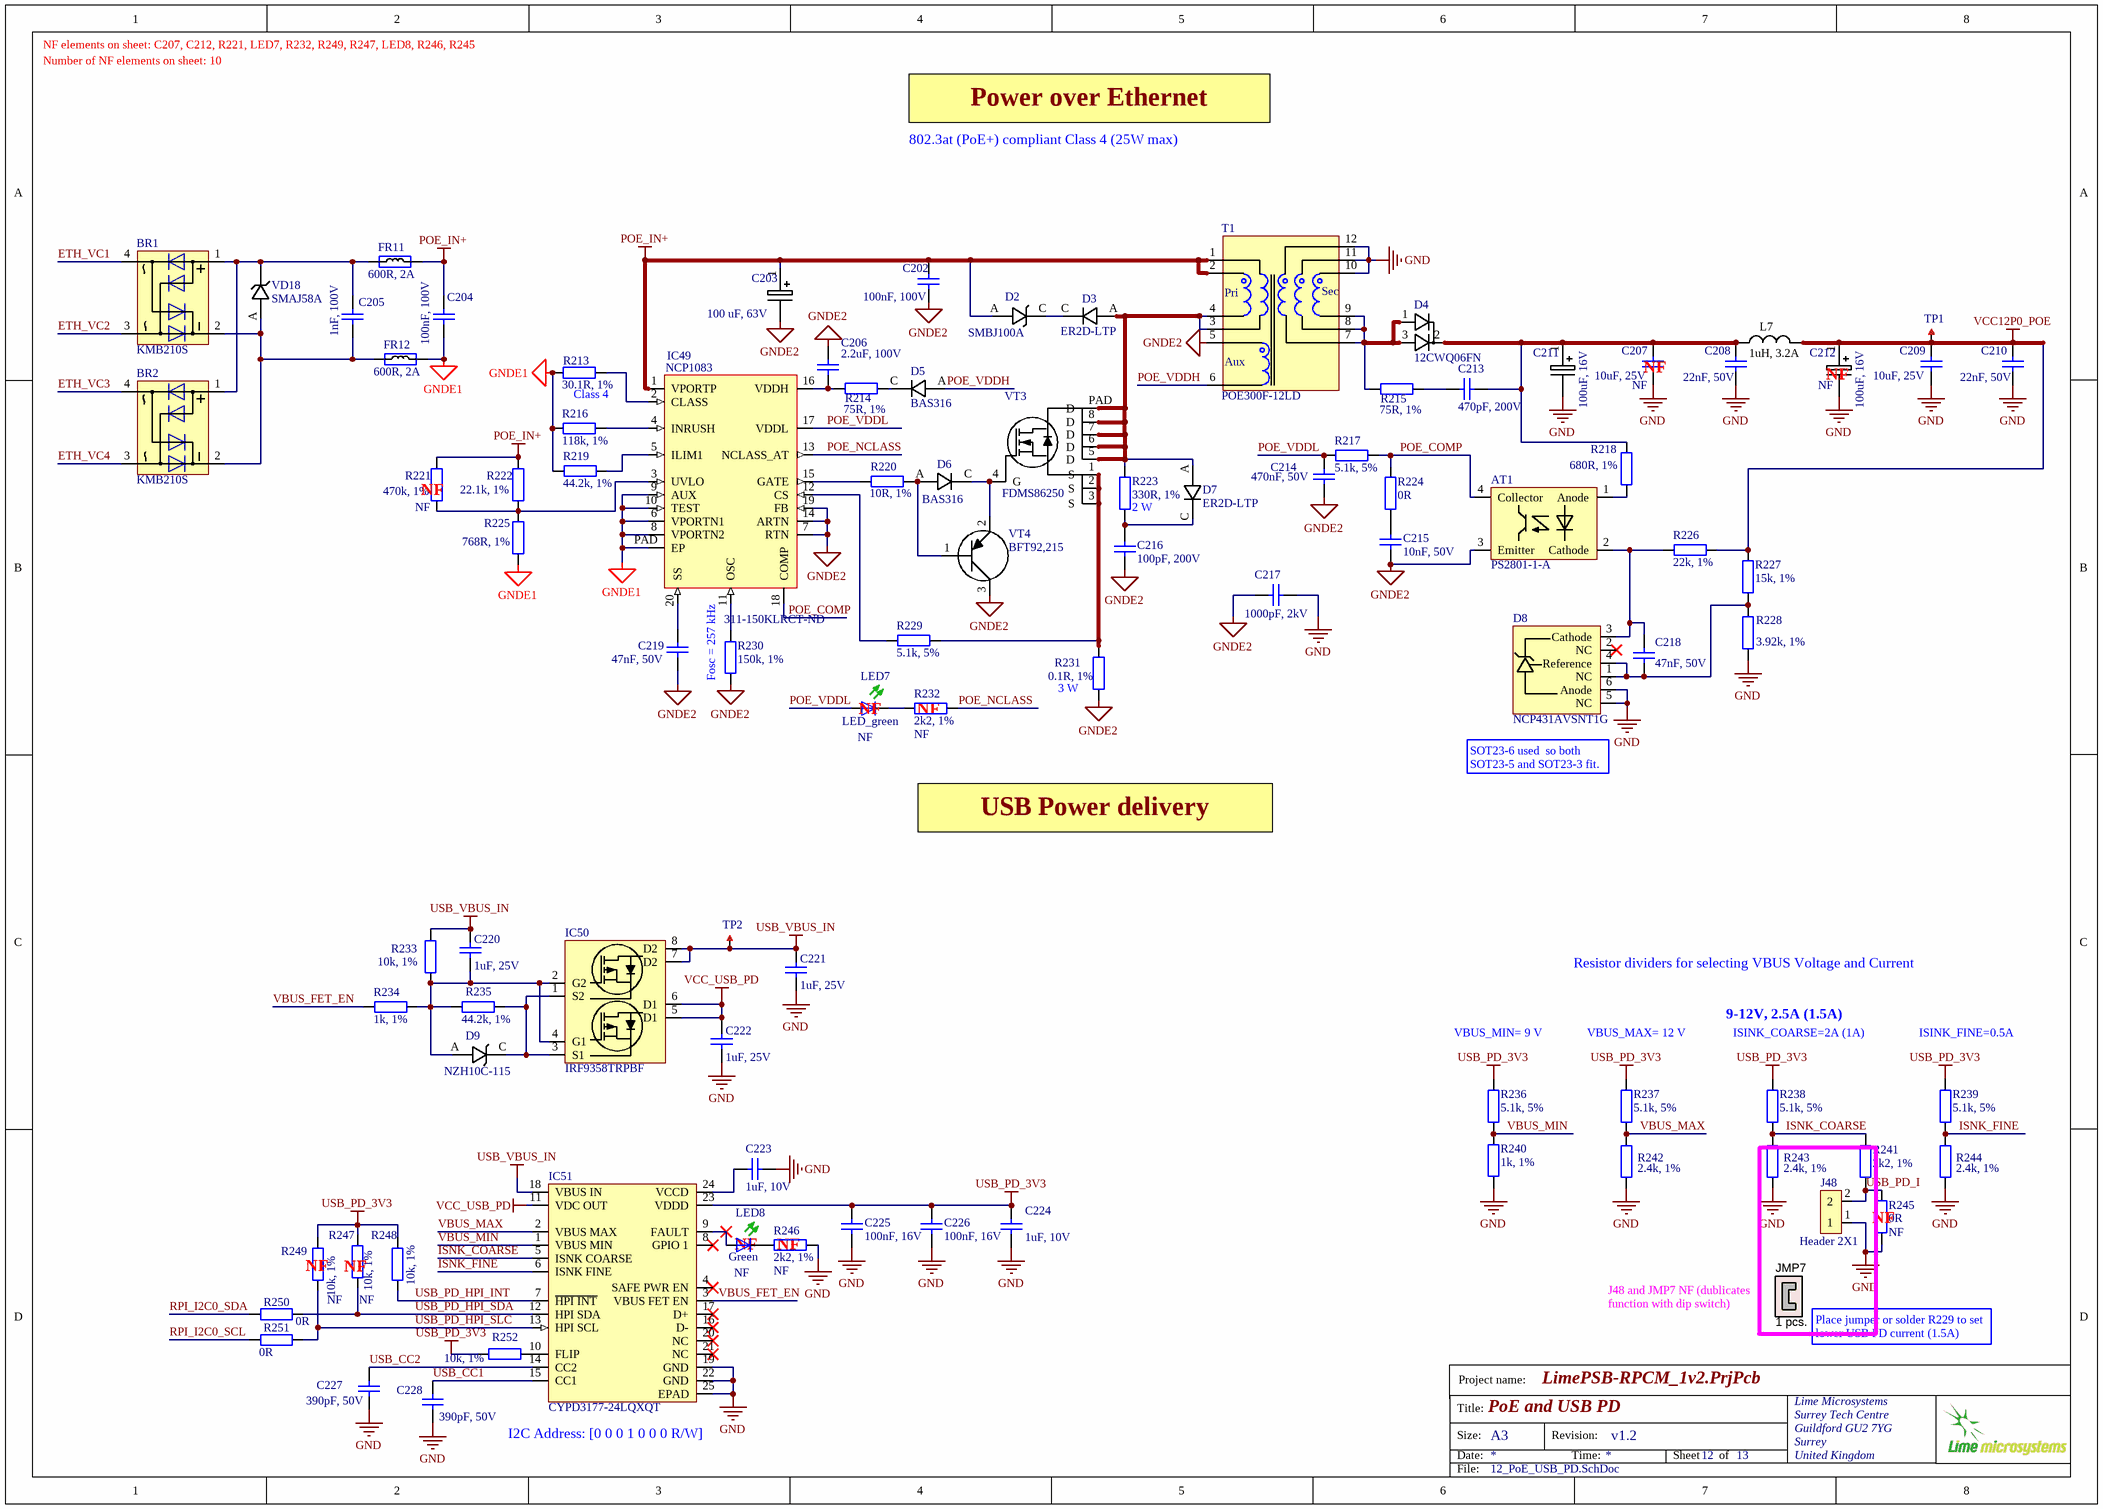
[diagram p11: 12_PoE_USB_PD.SchDoc]

### Parts
AT1  PS2801-1-A  [TCMT1107CT_optoisolator]
BR1  KMB210S  [KMB210S_RECTIFIER_BRIDGE]
BR2  KMB210S  [KMB210S_RECTIFIER_BRIDGE]
C202  100nF, 100V  [CAP0603]
C203  100 uF, 63V  [CAP_POL_D10_H10]
C204  100nF, 100V  [CAP0603]
C205  1nF, 100V  [CAP0603]
C206  2.2uF, 100V  [CAP1206]
C207  10uF, 25V  Assembly Info: NF  [CAP0805]
C208  22nF, 50V  [CAP0402]
C209  10uF, 25V  [CAP0805]
C210  22nF, 50V  [CAP0402]
C211  100uF, 16V  [CAP_POL_SIZE_F_v2]
C212  100uF, 16V  Assembly Info: NF  [CAP_POL_SIZE_F_v2]
C213  470pF, 200V  [CAP0603]
C214  470nF, 50V  [CAP0603]
C215  10nF, 50V  [CAP0402]
C216  100pF, 200V  [CAP0603]
C217  1000pF, 2kV  [CAP1812]
C218  47nF, 50V  [CAP0603]
C219  47nF, 50V  [CAP0603]
C220  1uF, 25V  [CAP0603]
C221  1uF, 25V  [CAP0603]
C222  1uF, 25V  [CAP0603]
C223  1uF, 10V  [CAP0402]
C224  1uF, 10V  [CAP0402]
C225  100nF, 16V  [CAP0402]
C226  100nF, 16V  [CAP0402]
C227  390pF, 50V  [CAP0402]
C228  390pF, 50V  [CAP0402]
D2  SMBJ100A  [SMBJ100A_DIODE_DO-214AA]
D3  ER2D-LTP  [ER2D-LTP_DIODE_DO-214AA]
D4  12CWQ06FN  [12CWQ06FN_diode_array_DPAK]
D5  BAS316  [BAS316_DIODE_SOD323]
D6  BAS316  [BAS316_DIODE_SOD323]
D7  ER2D-LTP  [ER2D-LTP_DIODE_DO-214AA]
D8  NCP431AVSNT1G  [SOT23-6]
D9  NZH10C-115  [NZH10C,115_shottky_diode_SOD123]
FR11  600R, 2A  [RES0805]
FR12  600R, 2A  [RES0805]
IC49  NCP1083  [NCP1083_PoE_controller_TSSOP20]
IC50  IRF9358TRPBF  [IRF9358TRPBF_DUAL_NMOS_SOIC8]
IC51  CYPD3177-24LQXQT  [USB_POWER_DISTR_CYPD3177_QFN24]
J48  Header 2X1  [HDR_1x2]
JMP7  1 pcs.  (mechanical)
L7  1uH, 3.2A  [NRS4018T3R3MDGJ_inductor]
LED7  LED_green  Assembly Info: NF  [LED-0603-GREEN]
LED8  Green  Assembly Info: NF  [LED-0603-GREEN]
R213  30.1R, 1%  [RES0402]
R214  75R, 1%  [RES0402]
R215  75R, 1%  [RES0402]
R216  118k, 1%  [RES0402]
R217  5.1k, 5%  [RES0402]
R218  680R, 1%  [RES0402]
R219  44.2k, 1%  [RES0402]
R220  10R, 1%  [RES0603]
R221  470k, 1%  Assembly Info: NF  [RES0402]
R222  22.1k, 1%  [RES0402]
R223  330R, 1%  [RES2512]
R224  0R  [RES0402]
R225  768R, 1%  [RES0402]
R226  22k, 1%  [RES0402]
R227  15k, 1%  [RES0402]
R228  3.92k, 1%  [RES0402]
R229  5.1k, 5%  [RES0402]
R230  150k, 1%  Supplier Part Number 1: 311-150KLRCT-ND  [RES0402]
R231  0.1R, 1%  [RES2512]
R232  2k2, 1%  Assembly Info: NF  [RES0402]
R233  10k, 1%  [RES0402]
R234  1k, 1%  [RES0402]
R235  44.2k, 1%  [RES0402]
R236  5.1k, 5%  [RES0402]
R237  5.1k, 5%  [RES0402]
R238  5.1k, 5%  [RES0402]
R239  5.1k, 5%  [RES0402]
R240  1k, 1%  [RES0402]
R241  2k2, 1%  [RES0402]
R242  2.4k, 1%  [RES0402]
R243  2.4k, 1%  [RES0402]
R244  2.4k, 1%  [RES0402]
R245  0R  Assembly Info: NF  [RES0402]
R246  2k2, 1%  Assembly Info: NF  [RES0402]
R247  10k, 1%  Assembly Info: NF  [RES0402]
R248  10k, 1%  [RES0402]
R249  10k, 1%  Assembly Info: NF  [RES0402]
R250  0R  [RES0402]
R251  0R  [RES0402]
R252  10k, 1%  [RES0402]
T1  POE300F-12LD  [POE300F50LD_TRANSFORMER]
TP1  TESTPOINT_PAD  [TP_PAD_1p5MM]  (value not drawn)  (no BOM)
TP2  TESTPOINT_PAD  [TP_PAD_1p5MM]  (value not drawn)  (no BOM)
VD18  SMAJ58A  [SMAJ58A_shottky_diode]
VT3  FDMS86250  [FDMS86250_NMOS_POWER56]
VT4  BFT92,215  [BFT92,215_PNP_STO23-3]

### Nets
GND: C207.1 C208.2 C209.1 C210.2 C211.2 C212.2 C217.1 C221.1 C222.1 C223.1 C224.1 C225.2 C226.2 C227.2 C228.2 D8.5(NC) D8.6(Anode) IC51.19(GND) IC51.22(GND) IC51.25(EPAD) J48.1 R228.2 R240.2 R242.1 R243.1 R244.1 R245.2 R246.2 T1.10 T1.11 T1.12
GNDE1: C204.1 FR12.2 IC49.6(VPORTN1) IC49.8(VPORTN2) IC49.9(AUX) IC49.10(TEST) IC49.PAD(EP) R213.1 R216.1 R219.2 R225.2
GNDE2: AT1.3(Emitter) C202.1 C203.2 C206.2 C214.1 C215.1 C216.2 C217.2 C219.1 IC49.7(RTN) IC49.14(ARTN) IC49.19(FB) R230.1 R231.1 T1.5 VT4.3(C)
POE_IN+: C202.2 C203.1 C204.2 D2.A FR11.2 IC49.1(VPORTP) R221.2 R222.2 T1.1 T1.2
USB_PD_3V3: C224.2 C225.1 C226.1 IC51.23(VDDD) R236.1 R237.1 R238.1 R239.1 R247.2 R248.2 R249.2 R252.1
USB_VBUS_IN: C220.2 C221.2 IC50.7(D2) IC50.8(D2) IC51.18(VBUS_IN) R233.2 TP2.1
VCC12P0_POE: C209.2 C210.1 C212.1 L7.2 R226.1 R227.1 TP1.1
VCC_USB_PD: C222.2 IC50.5(D1) IC50.6(D1) IC51.11(VDC_OUT)
ETH_VC1: BR1.4
ETH_VC2: BR1.3
ETH_VC3: BR2.4
ETH_VC4: BR2.3
ISNK_COARSE: IC51.5(ISNK_COARSE) R238.2 R241.2 R243.2
ISNK_FINE: IC51.6(ISNK_FINE) R239.2 R244.2
POE_COMP: AT1.4(Collector) IC49.18(COMP) R217.1 R224.1
POE_NCLASS: IC49.13(NCLASS_AT) R232.2
POE_VDDH: D5.A T1.6
POE_VDDL: C214.2 IC49.17(VDDL) LED7.A R217.2
RPI_I2C0_SCL: R251.2
RPI_I2C0_SDA: R250.2
USB_CC1: C228.1 IC51.15(CC1)
USB_CC2: C227.1 IC51.14(CC2)
USB_PD_HPI_INT: IC51.7(~{HPI_INT}) R248.1
USB_PD_HPI_SDA: IC51.12(HPI_SDA) R247.1 R250.1
USB_PD_HPI_SLC: IC51.13(HPI_SCL) R249.1 R251.1
USB_PD_I: J48.2 R241.1 R245.1
VBUS_FET_EN: IC51.3(VBUS_FET_EN) R234.2
VBUS_MAX: IC51.2(VBUS_MAX) R237.2 R242.2
VBUS_MIN: IC51.1(VBUS_MIN) R236.2 R240.1
NetAT1_1: AT1.1(Anode) R218.2
NetAT1_2: AT1.2(Cathode) C218.2 D8.3(Cathode) R226.2
NetBR1_1: BR1.1 BR2.1 C205.1 FR11.1 VD18.K
NetBR1_2: BR1.2 BR2.2 C205.2 FR12.1 VD18.A
NetC206_1: C206.1 IC49.16(VDDH) R214.1
NetC207_2: C207.2 C208.1 C211.1 C213.2 D4.2 L7.1 R218.1
NetC213_1: C213.1 R215.2
NetC215_2: C215.2 R224.2
NetC216_1: C216.1 D7.C R223.1
NetC218_1: C218.1 D8.1(NC) D8.4(Reference) R227.2 R228.1
NetC219_2: C219.2 IC49.20(SS)
NetC220_1: C220.1 D9.A IC50.2(G2) IC50.4(G1) R233.1 R234.1 R235.2
NetC223_2: C223.2 IC51.24(VCCD)
NetD2_C: D2.C D3.C
NetD3_A: D3.A D7.A R223.2 T1.3 T1.4 VT3.5(D) VT3.6(D) VT3.7(D) VT3.8(D) VT3.PAD(D)
NetD4_1: D4.1 D4.3 R215.1 T1.7 T1.8 T1.9
NetD5_C: D5.C R214.2
NetD6_A: D6.A R220.1 VT4.1(S)
NetD6_C: D6.C VT3.4(G) VT4.2(E)
NetD9_C: D9.C IC50.1(S2) IC50.3(S1) R235.1
NetIC49_2: IC49.2(CLASS) R213.2
NetIC49_3: IC49.3(UVLO) R221.1 R222.1 R225.1
NetIC49_4: IC49.4(INRUSH) R216.2
NetIC49_5: IC49.5(ILIM1) R219.1
NetIC49_11: IC49.11(OSC) R230.2
NetIC49_12: IC49.12(CS) R229.2
NetIC49_15: IC49.15(GATE) R220.2
NetIC51_9: IC51.9(FAULT) LED8.A
NetIC51_10: IC51.10(FLIP) R252.2
NetLED7_K: LED7.K(C) R232.1
NetLED8_K: LED8.K(C) R246.1
NetR229_1: R229.1 R231.2 VT3.1(S) VT3.2(S) VT3.3(S)

Not connected (* = marked no-connect by the designer): D8 2(NC)*; IC51 4(SAFE_PWR_EN)* 8(GPIO_1)* 16(D-)* 17(D+)* 20(NC)* 21(NC)*; JMP7 1 2

### Notes on the sheet
- NF elements on sheet: C207, C212, R221, LED7, R232, R249, R247, LED8, R246, R245
- Number of NF elements on sheet: 10
- 802.3at (PoE+) compliant Class 4 (25W max)
- Power over Ethernet
- (near C207) NF
- (near C212) NF
- Class 4
- (near R221) NF
- (near R223) 2 W
- Fosc = 257 kHz
- (near LED7) NF
- (near R232) NF
- (near R231) 3 W
- (near D8) SOT23-6 used  so both SOT23-5 and SOT23-3 fit.
- USB Power delivery
- Resistor dividers for selecting VBUS Voltage and Current
- (near R236) VBUS_MIN= 9 V
- (near R237) VBUS_MAX= 12 V
- 9-12V, 2.5A (1.5A)
- (near R238) ISINK_COARSE=2A (1A)
- (near R239) ISINK_FINE=0.5A
- NF
- (near R246) NF
- (near R245) NF
- (near R249) NF
- (near R247) NF
- (near JMP7) J48 and JMP7 NF (dublicates function with dip switch)
- Place jumper or solder R229 to set lower USB PD current (1.5A)
- (near IC51) I2C Address: [0 0 0 1 0 0 0 R/W]
- Project name:
- Title:
- Size:
- Date:
- A3
- Revision:
- Time:
- Sheet
- of
- File:
- (in symbol POE300F-50LD_transformer) Pri; Sec; Aux